# Altium project Car_Elec_Finale.PrjPcb
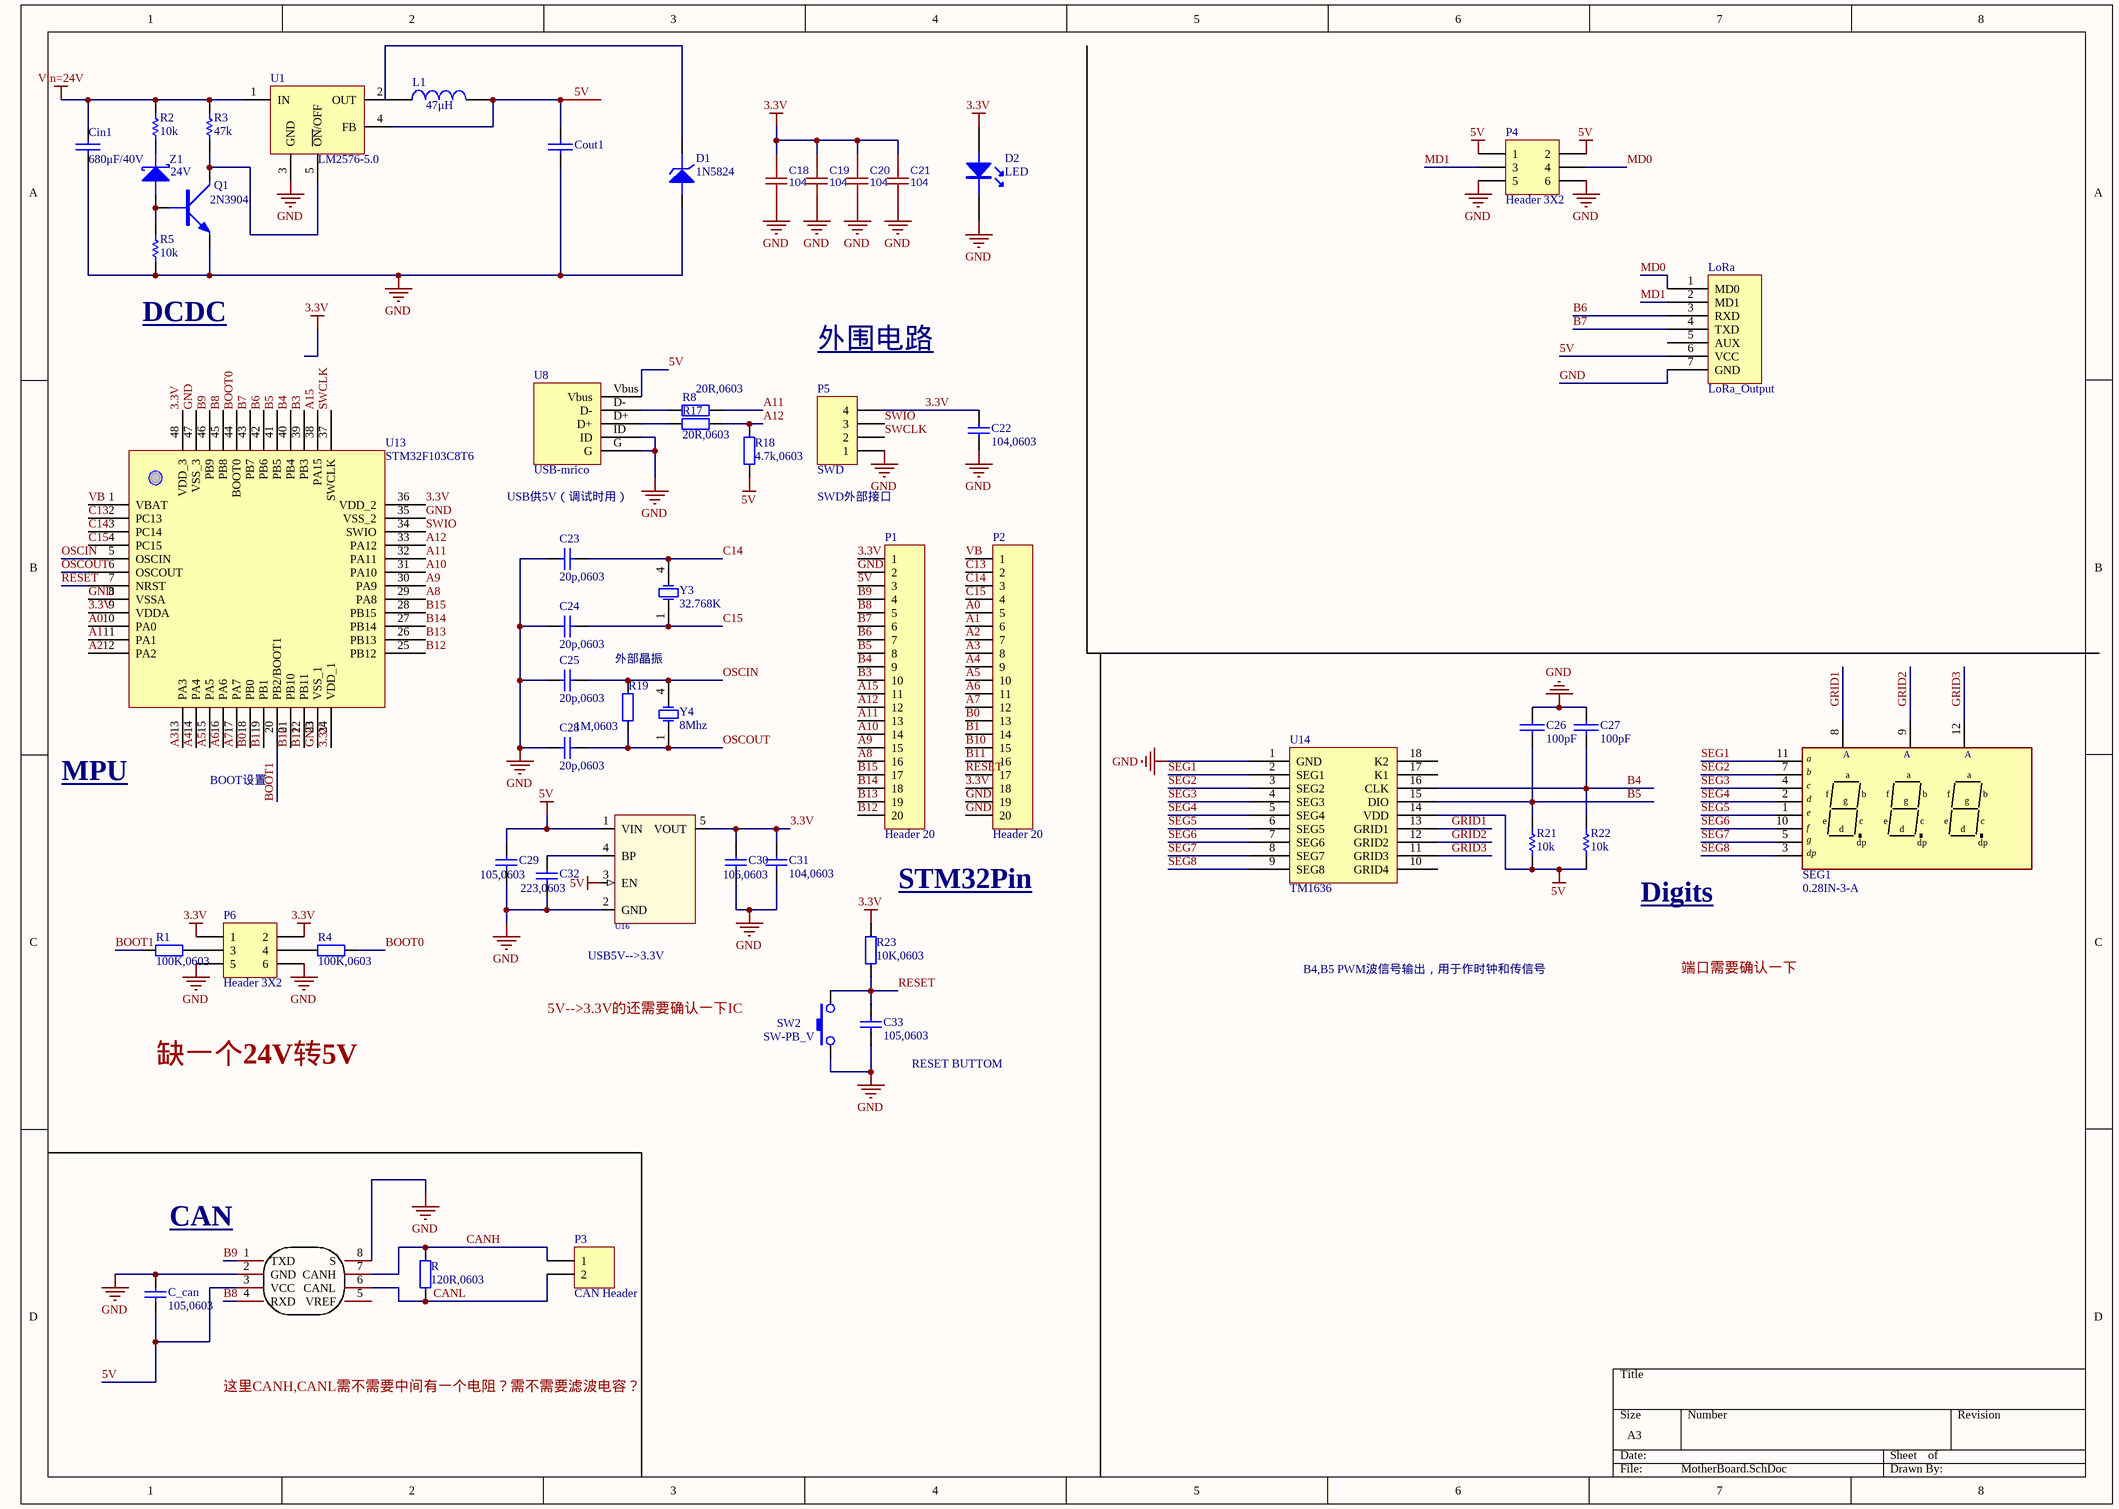
[diagram p0: MotherBoard.SchDoc]
1 sheet, 54 parts. Net scope: global (net labels, ports and power ports of the same name join across sheets).
Board files: MotherBoard.PcbDoc, MotherBoardV2.PcbDoc

## Sheet MotherBoard.SchDoc
size A3; SheetNumber: 1; SheetTotal: 1

### Parts
C18  104  [0805]
C19  104  [0805]
C20  104  [0805]
C21  104  [0805]
C22  104,0603  [C0603]
C23  20p,0603  [C0603]
C24  20p,0603  [C0603]
C25  20p,0603  [C0603]
C26  100pF  [0201C]
C27  100pF  [0201C]
C28  20p,0603  [C0603]
C29  105,0603  [C0603]
C30  106,0603  [C0603]
C31  104,0603  [C0603]
C32  223,0603  [C0603]
C33  105,0603  [C0603]
C_can  105,0603  [C0603]
Cin1  680μF/40V  [0201C]
Cout1  (no value)  [0201C]
D1  1N5824  [DO-15]
D2  LED  [LED]
L1  47μH  [AL0204]
LoRa  LoRa_Output  [LoRa_Output]
P1  Header 20  [HDR1X20]
P2  Header 20  [HDR1X20]
P3  CAN Header  [HDR1X2]
P4  Header 3X2  [HDR2X3]
P5  SWD  [HDR1X4]
P6  Header 3X2  [HDR2X3]
Q1  2N3904  [SOT-23]
R  120R,0603  [R0603]
R1  100K,0603  [R0603]
R2  10k  [0201R]
R3  47k  [0201R]
R4  100K,0603  [R0603]
R5  10k  [0201R]
R8  20R,0603  [R0603]
R17  20R,0603  [R0603]
R18  4.7k,0603  [R0603]
R19  1M,0603  [R0603]
R21  10k  [0201R]
R22  10k  [0201R]
R23  10K,0603  [R0603]
SEG1  0.28IN-3-A  [0.36IN-3P]
SW2  SW-PB_V  [KEY-SMT]
U1  LM2576-5.0  [TO220-5A]
U8  USB-mrico  [Micro_USB]
U13  STM32F103C8T6  [48P]
U14  TM1636  [DIP18]
U15  TJA1050T/CM,118  [SOIC-8_L5.0-W4.0-P1.27-LS6.0-BL]  (value not drawn)
U16  RT9193  [SOT-23-5]  (value not drawn)
Y3  32.768K  [XTAL1]
Y4  8Mhz  [XTAL1]
Z1  24V  [DO-15]

### Nets
3.3V: C18.2 C19.2 C20.2 C21.2 C22.2 C30.1 C31.1 D2.A P1.1 P2.18 P5.4 P6.1 P6.2 R23.2 U13.9(VDDA) U13.24(VDD_1) U13.36(VDD_2) U13.48(VDD_3) U16.5(VOUT)
5V: C29.1 C_can.1 Cout1.1 L1.2 LoRa.6(VCC) P1.3 P4.1 P4.2 R18.1 R21.1 R22.1 U1.4(FB) U8.Vbus U14.14(VDD) U15.3(VCC) U16.1(VIN) U16.3(EN)
GND: C18.1 C19.1 C20.1 C21.1 C22.1 C23.1 C24.1 C25.1 C26.2 C27.2 C28.1 C29.2 C30.2 C31.2 C32.2 C33.1 C_can.2 Cin1.1 Cout1.2 D1.A D2.K LoRa.7(GND) P1.2 P2.19 P2.20 P4.5 P4.6 P5.1 P6.5 P6.6 Q1.E R5.1 SW2.1 U1.3(GND) U8.G U8.ID U13.8(VSSA) U13.23(VSS_1) U13.35(VSS_2) U13.47(VSS_3) U14.1(GND) U15.2(GND) U15.8(S) U16.2(GND)
Vin=24V: Cin1.2 R2.2 R3.2 U1.1(IN)
A0: P2.5 U13.10(PA0)
A1: P2.6 U13.11(PA1)
A2: P2.7 U13.12(PA2)
A3: P2.8 U13.13(PA3)
A4: P2.9 U13.14(PA4)
A5: P2.10 U13.15(PA5)
A6: P2.11 U13.16(PA6)
A7: P2.12 U13.17(PA7)
A8: P1.16 U13.29(PA8)
A9: P1.15 U13.30(PA9)
A10: P1.14 U13.31(PA10)
A11: P1.13 R8.2 U13.32(PA11)
A12: P1.12 R17.2 R18.2 U13.33(PA12)
A15: P1.11 U13.38(PA15)
B0: P2.13 U13.18(PB0)
B1: P2.14 U13.19(PB1)
B3: P1.10 U13.39(PB3)
B4: C27.1 P1.9 R22.2 U13.40(PB4) U14.16(CLK)
B5: C26.1 P1.8 R21.2 U13.41(PB5) U14.15(DIO)
B6: LoRa.3(RXD) P1.7 U13.42(PB6)
B7: LoRa.4(TXD) P1.6 U13.43(PB7)
B8: P1.5 U13.45(PB8) U15.4(RXD)
B9: P1.4 U13.46(PB9) U15.1(TXD)
B10: P2.15 U13.21(PB10)
B11: P2.16 U13.22(PB11)
B12: P1.20 U13.25(PB12)
B13: P1.19 U13.26(PB13)
B14: P1.18 U13.27(PB14)
B15: P1.17 U13.28(PB15)
BOOT0: R4.1 U13.44(BOOT0)
BOOT1: R1.1 U13.20(PB2/BOOT1)
C13: P2.2 U13.2(PC13)
C14: C23.2 P2.3 U13.3(PC14) Y3.4(OSC2)
C15: C24.2 P2.4 U13.4(PC15) Y3.1(OSC1)
CANH: P3.1 R.2 U15.7(CANH)
CANL: P3.2 R.1 U15.6(CANL)
GRID1: SEG1.8 U14.13(GRID1)
GRID2: SEG1.9 U14.12(GRID2)
GRID3: SEG1.12 U14.11(GRID3)
MD0: LoRa.1(MD0) P4.4
MD1: LoRa.2(MD1) P4.3
OSCIN: C25.2 R19.2 U13.5(OSCIN) Y4.4(OSC2)
OSCOUT: C28.2 R19.1 U13.6(OSCOUT) Y4.1(OSC1)
RESET: C33.2 P2.17 R23.1 SW2.2 U13.7(NRST)
SEG1: SEG1.11 U14.2(SEG1)
SEG2: SEG1.7 U14.3(SEG2)
SEG3: SEG1.4 U14.4(SEG3)
SEG4: SEG1.2 U14.5(SEG4)
SEG5: SEG1.1 U14.6(SEG5)
SEG6: SEG1.10 U14.7(SEG6)
SEG7: SEG1.5 U14.8(SEG7)
SEG8: SEG1.3 U14.9(SEG8)
SWCLK: P5.2 U13.37(SWCLK)
SWIO: P5.3 U13.34(SWIO)
VB: P2.1 U13.1(VBAT)
NetC32_1: C32.1 U16.4(BP)
NetD1_K: D1.K L1.1
NetP6_3: P6.3 R1.2
NetP6_4: P6.4 R4.2
NetQ1_B: Q1.B R5.2 Z1.A
NetQ1_C: Q1.C R3.1 U1.5(~{ON}/OFF)
NetR2_1: R2.1 Z1.K
NetR8_1: R8.1 U8.D-
NetR17_1: R17.1 U8.D+

Not connected (* = marked no-connect by the designer): LoRa 5(AUX); U1 2(OUT); U14 10(GRID4) 17(K1) 18(K2); U15 5(VREF)

### Notes on the sheet
- (near R5) DCDC
- 外围电路
- USB供5V（调试时用）
- SWD外部接口
- 外部晶振
- MPU
- BOOT设置
- STM32Pin
- Digits
- (near U16) USB5V-->3.3V
- B4,B5 PWM波信号输出，用于作时钟和传信号
- 端口需要确认一下
- 5V-->3.3V的还需要确认一下IC
- 缺一个24V转5V
- (near C33) RESET BUTTOM
- CAN
- 这里CANH,CANL需不需要中间有一个电阻？需不需要滤波电容？
- (in symbol 0.28IN-3-A) A; a; b; c; f; d; g; e; dp

### Library data of the parts
C18-C21 = 105: BOM_Manufacturer: FH; BOM_Manufacturer Part: 0805B103K101NT; nameAlias: Capacitance; Contributor: LCSC; BOM_Supplier: LCSC; BOM_Supplier Part: C128805; spicePre: C; spiceSymbolName: 0805B103K101NT
C22-C25 C28-C33 C_can = Cap: Capacitor; Value: 104; Published: 8-Jun-2000; LatestRevisionDate: 17-Jul-2002; LatestRevisionNote: Re-released for DXP Platform.; Publisher: Altium Limited
C26 C27 Cin1 Cout1 = CAP: 无极性电容
D1 = DIODE ZENER: 稳压二极管
D2 = LED: pin to pad: A>1 K>2
L1 = INDUCTOR
P1 P2 = Header 20: Header, 20-Pin; LatestRevisionDate: 17-Jul-2002; LatestRevisionNote: Re-released for DXP Platform.; Publisher: Altium Limited
P3 = Header 2: Header, 2-Pin; LatestRevisionDate: 17-Jul-2002; LatestRevisionNote: Re-released for DXP Platform.; Publisher: Altium Limited
P4 P6 = Header 3X2: Header, 3-Pin, Dual row; LatestRevisionDate: 17-Jul-2002; LatestRevisionNote: Re-released for DXP Platform.; Publisher: Altium Limited
P5 = Header 4: Header, 4-Pin; LatestRevisionDate: 17-Jul-2002; LatestRevisionNote: Re-released for DXP Platform.; Publisher: Altium Limited
Q1 = NPN: NPN三极管
R R1 R4 R8 R17-R19 R23 = Res2: Resistor; Published: 8-Jun-2000; LatestRevisionDate: 17-Jul-2002; LatestRevisionNote: Re-released for DXP Platform.; Publisher: Altium Limited
R2 R3 R5 R21 R22 = RES
SEG1 = 0.28IN-3-A: 3位0.28寸共阳数码管
SW2 = SW-PB_V: SWITCH
U1 = LM2576-5.0: DC降压芯片
U8 = usb-STM
U14 = TM1636: TM1636LED控制芯片
U15 = TJA1050T/CM,118: Manufacturer: NXP(恩智浦); Add into BOM: yes; Protocol: CAN总线; Supply Voltage: 4.75V ~ 5.25V; Name: TJA1050T/CM,118; Symbol: TJA1050T/CM,118; Device: TJA1050T/CM,118; LCSC Part Name: TJA1050T/CM,118; Supplier Part: C6952; Manufacturer Part: TJA1050T/CM,118; Supplier Footprint: SOIC-8_150mil; JLCPCB Part Class: Basic Part; Datasheet: https://atta.szlcsc.com/upload/public/pdf/source/20140411/1457707042917.pdf; Supplier: LCSC; Convert to PCB: yes; Type: 收发器
U16 = RT9193X_5P: ICA_MFR_NAME: RICHTEK; ICA_PARTNUM: $$2191094$$RT9193-15CU5; Part Number: TMP-13
Y3 Y4 = XTAL: Crystal Oscillator; Published: 8-Jun-2000; LatestRevisionDate: 17-Jul-2002; LatestRevisionNote: Re-released for DXP Platform.; Publisher: Altium Limited
Z1 = DIODE SCHOTTKY: 肖特基二极管